# Altium schematic sheet PSU.SchDoc
size A; SheetNumber: 5; SheetTotal: 5
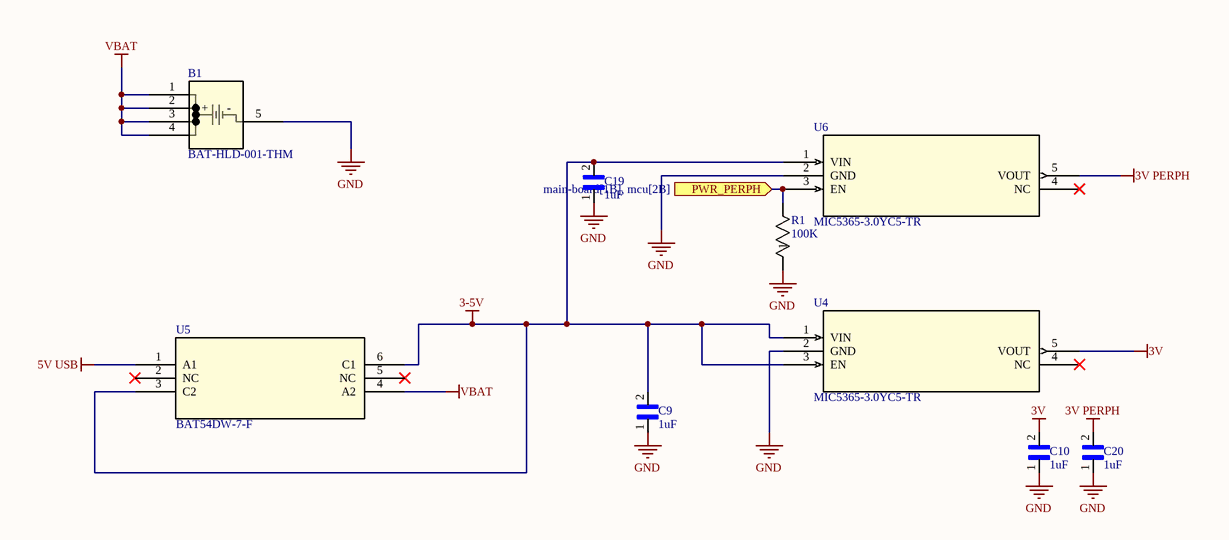
[diagram p0: PSU.SchDoc]

## Parts
B1  BAT-HLD-001-THM  [BAT-HLD-001-THM_TEC]
C9  1uF  [CAPC1608X90N]
C10  1uF  [CAPC1608X90N]
C19  1uF  [CAPC1608X90N]
C20  1uF  [CAPC1608X90N]
R1  100K  [RC0603N_YAG]
U4  MIC5365-3.0YC5-TR  [SC-70_C5_MCH]
U5  BAT54DW-7-F  [SOT-363_DIO]
U6  MIC5365-3.0YC5-TR  [SC-70_C5_MCH]

## Ports
PWR_PERPH (in, see main-board[1B], mcu[2B])

## Nets
3-5V: C9.2 C19.2 U4.1(VIN) U4.3(EN) U5.3(C2) U5.6(C1) U6.1(VIN)
3V: C10.2 U4.5(VOUT)
3V PERPH: C20.2 U6.5(VOUT)
5V USB: U5.1(A1)
GND: B1.5(NEGATIVE) C9.1 C10.1 C19.1 C20.1 R1.1 U4.2(GND) U6.2(GND)
VBAT: B1.1(POSITIVE) B1.2(POSITIVE) B1.3(POSITIVE) B1.4(POSITIVE) U5.4(A2)
PWR_PERPH: R1.2 U6.3(EN) ; port PWR_PERPH

Not connected (* = marked no-connect by the designer): U4 4(NC)*; U5 2(NC)* 5(NC)*; U6 4(NC)*

## Notes on the sheet
- (in symbol BAT-HLD-001-THM) +; -

## Library data of the parts
B1 = BAT-HLD-001-THM: CR2032 Battery holder. 2.7V-3V. / https://www.digikey.com/en/products/detail/te-connectivity-linx/BAT-HLD-001-THM/3044009; Mfr_Name: TE Connectivity; RefDes: RefDes; Type: Type; Supplier 1: Digikey; Supplier Part Number 1: BAT-HLD-001-THM-ND
C9 C19 = CL10B105KP8NNNC: CL10B105KP8NNNC. / https://www.digikey.com/en/products/detail/samsung-electro-mechanics/CL10B105KP8NNNC/3887604?s=N4IgTCBcDaIMIBkCMAGAQqgrAaQAoA4A5YuEAXQF8g; Package: None; Price: None; Value: *; MP: CL10B105KP8NNNC; Availability: Unavailable; Supplier 1: Avnet; Supplier Part Number 1: CL10B105KP8NNNC
C10 = CL10B105KP8NNNC: CL10B105KP8NNNC / https://www.digikey.com/en/products/detail/samsung-electro-mechanics/CL10B105KP8NNNC/3887604?s=N4IgTCBcDaIMIBkCMAGAQqgrAaQAoA4A5YuEAXQF8g; Package: None; Price: None; Value: *; MP: CL10B105KP8NNNC; Availability: Unavailable; Supplier 1: Avnet; Supplier Part Number 1: CL10B105KP8NNNC
C20 = CL10B105KP8NNNC: Package: None; Price: None; Value: *; MP: CL10B105KP8NNNC; Availability: Unavailable; Supplier 1: Avnet; Supplier Part Number 1: CL10B105KP8NNNC
R1 = RC0603FR-07100KL: Mfr_Name: Yageo
U4 U6 = MIC5365-3.0YC5-TR: 3V Linear Voltage Regulator. / https://www.digikey.com/en/products/detail/microchip-technology/MIC5365-3-0YC5-TR/1868092?s=N4IgTCBcDaILIEkDCBWAzANhQWjQOgAYBNVbAFQCUQBdAXyA; Mfr_Name: Microchip; RefDes: RefDes; Type: Type; Supplier 1: Newark; Supplier Part Number 1: 55AC2794
U5 = BAT54DW-7-F: 2 Diode Array, 30V@100mA, Surface mount. Schottky. 6-TSSOP. / https://www.diodes.com/assets/Datasheets/BAT54DW.pdf; Mfr_Name: Diodes Inc; RefDes: RefDes; Type: Type; Supplier 1: Arrow Electronics; Supplier Part Number 1: BAT54DW-7-F